# EAGLE board jamma-streamer (EAGLE 9.6.2)
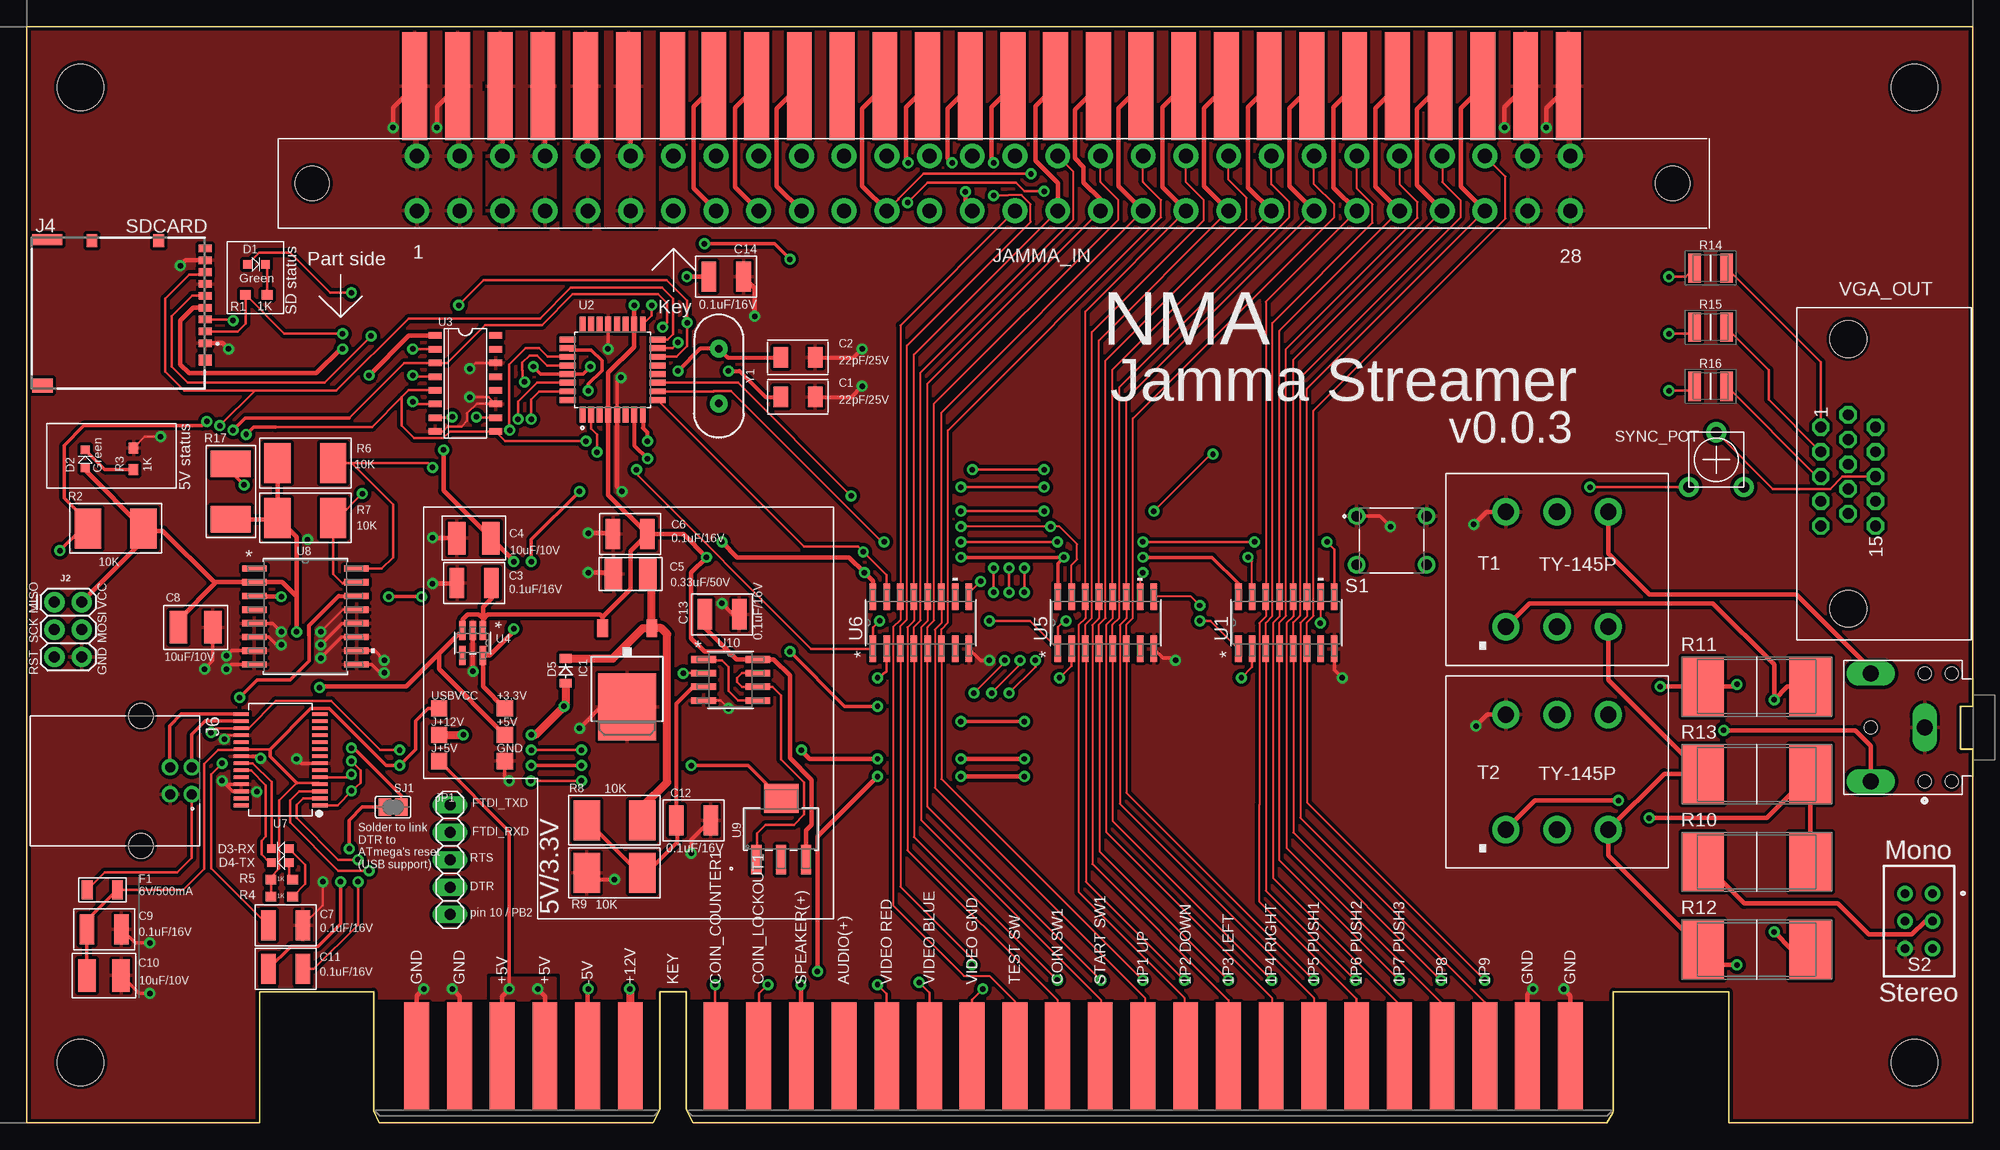
[diagram p7: board, top side]
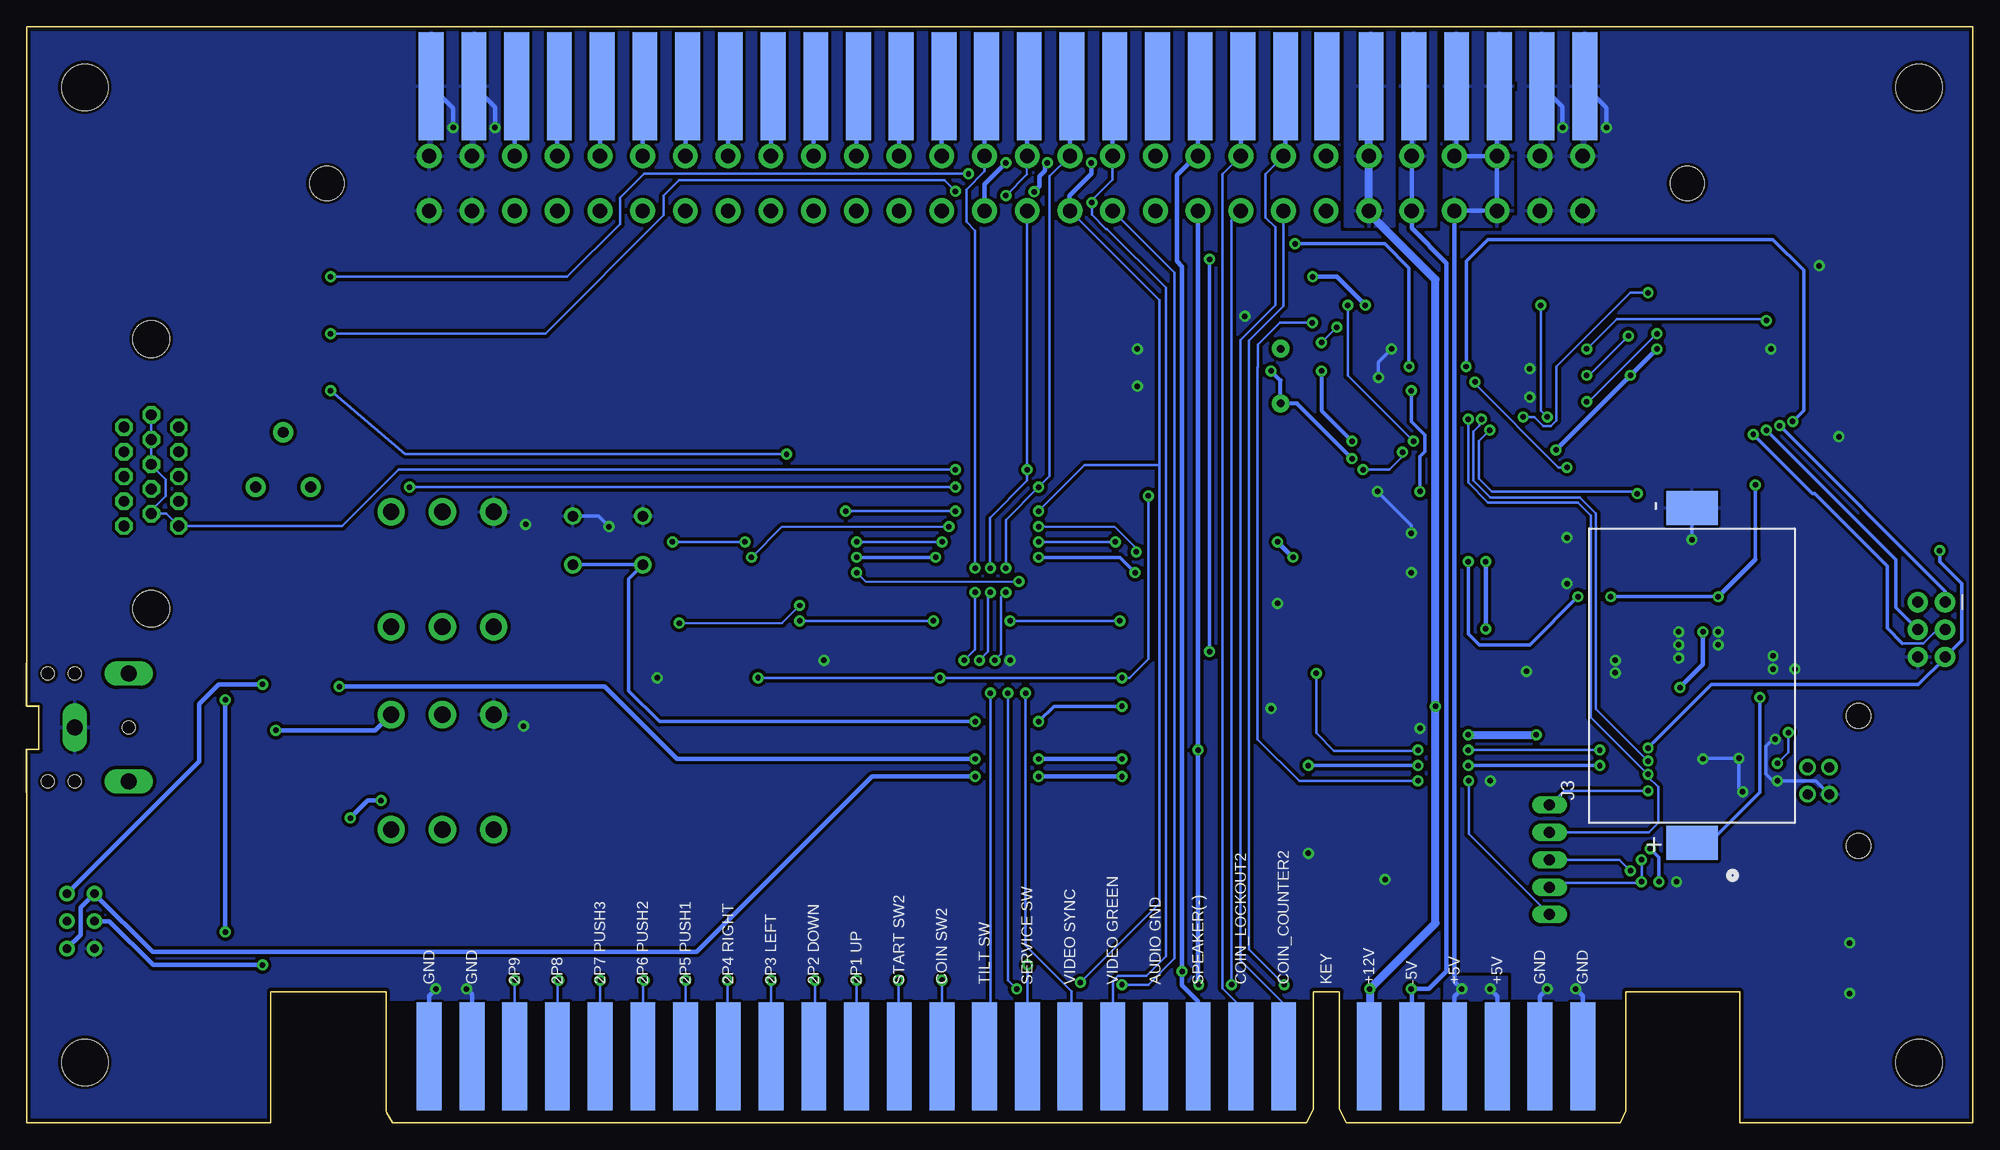
[diagram p8: board, bottom side, seen from below]

Size 180.34 x 101.59 mm. Coordinates in mm from the lower left corner, seen from the top.
Outline: 0,0 21.59,0 21.59,12.16 32.13,12.16 32.13,1.11 32.64,0 58.04,0 58.67,1.24 58.67,12.16 61.09,12.16 61.09,1.24 61.72,0 146.43,0 146.98,0.95 147.07,1.11 147.07,12.16 157.73,12.16 157.73,0 180.34,0 180.34,34.61 179.23,34.61 179.23,38.58 180.34,38.58 180.34,101.59 0,101.59 0,0
Copper layers (1*16): Top 0.035mm / dielectric 1.5mm / Bottom 0.035mm
Design rules "SparkFun": minimum track width 8mil, minimum drill 20mil, track to track 8mil, track to pad 8mil, pad to pad 8mil, via to via 8mil, smd to smd 8mil, copper to edge 10mil, drill to drill 8mil, minimum pad ring 12mil, minimum via ring 10mil, stop-mask expansion 4mil, vias tented up to drill 25mil, thermal gap 10mil
Holes 4.3 mm at 4.98,95.99 4.98,5.59 174.98,5.59 174.98,95.99
tKeepout: area 32.4,0 to 146.7,11.6
bKeepout: area 32.4,0 to 147.3,10.8
vRestrict: area 32,0 to 147.3,12.2

## Footprints (pad centres in the part's own frame; a part is rotated, then mirrored left to right if it is on the bottom)
TP15SQ = smd 1.5 x 1.5: TP 0,0
KEMET-C1206C220K3HACTU = smd 1.35 x 1.9: 1 -1.6,0; 2 1.6,0
KEMET-C1210C104K4J = smd 1.35 x 2.8: 1 -1.6,0; 2 1.6,0
KEMET-C1210C106K8N = smd 1.62 x 3.01: 1 -1.59,0; 2 1.59,0
KEMET-C1206X334K5R = smd 1.62 x 3.01: 1 -1.59,0; 2 1.59,0
604-APTD1608LCGCK = smd 0.8 x 0.8: + -0.825,0; - 0.825,0
DIODE-RRE07VTM4SFHTR = smd 0.8 x 1.1: 1 -1.15,0; 2 1.15,0
FUSE-1206L050YR = smd 1 x 1.8: 1 -1.4,0; 2 1.4,0
TO252 = smd 1 x 1.6: 1 -2.28,-4.8; 2 2.28,-4.8 | smd 5.4 x 6.2: 3 0,2.5
CUI_SJ1-3523N = drill 1.5 pad 2 long: 1 0,0; 2 5,-5; 3 5,5 | hole 1.2: -2.5,5; 0,5; 5,0; -2.5,-5; 0,-5
2X3 = drill 1.016 pad 1.88: 1 0,0; 2 0,2.54; 3 2.54,0; 4 2.54,2.54; 5 5.08,0; 6 5.08,2.54
796136-1 = smd 3.15 x 4.78: 1 -15.52,0; 2 15.52,0
DM3AT-SF-PEJM5_1 = smd 0.7 x 1.2: 1 -4.191,0.057; 2 -5.291,0.057; 3 -6.391,0.057; 4 -7.491,0.057; 5 -8.591,0.057; 6 -9.691,0.057; 7 -10.791,0.057; 8 -11.891,0.057; 10 -12.991,0.057 | smd 1.2 x 1: 9 -13.691,-10.443; 12 -13.691,-4.243 | smd 1 x 1.2: 11 -2.641,0.057 | smd 1 x 2.8: 13 -13.791,-14.593 | smd 1.3 x 1.9: 14 -0.291,-15.043
TE_292304-1 = drill 0.92: 1 1.25,4.71; 2 -1.25,4.71; 3 -1.25,2.71; 4 1.25,2.71 | hole 2.3: -6.02,0; 6.02,0
JAMMA_HORIZ_TOP = smd 2.3 x 10: 1 -53.46,0; 2 -49.5,0; 3 -45.54,0; 4 -41.58,0; 5 -37.62,0; 6 -33.66,0; 7 -29.55,0; 8 -25.74,0; 9 -21.78,0; 10 -17.82,0; 11 -13.86,0; 12 -9.9,0; 13 -5.94,0; 14 -1.98,0; 15 1.98,0; 16 5.94,0; 17 9.9,0; 18 13.86,0; 19 17.82,0; 20 21.78,0; 21 25.74,0; 22 29.7,0; 23 33.66,0; 24 37.62,0; 25 41.58,0; 26 45.54,0; 27 49.5,0; 28 53.46,0
JAMMA_HORIZ_BOTTOM = smd 2.3 x 10 bottom: _A 33.66,0; _B 37.62,0; _C 41.58,0; _D 45.54,0; _E 49.5,0; _F 53.46,0; A -53.46,0; B -49.5,0; C -45.54,0; D -41.58,0; E -37.62,0; F -33.66,0; H -29.55,0; J -25.74,0; K -21.78,0; L -17.82,0; M -13.86,0; N -9.9,0; P -5.94,0; R -1.98,0; S 1.98,0; T 5.94,0; U 9.9,0; V 13.86,0; W 17.82,0; X 21.78,0; Y 25.74,0; Z 29.7,0
JAMMA_FEMALE_56 = drill 1.32 pad 2.3: 1 -53.34,-2.54; 2 -49.38,-2.54; 3 -45.42,-2.54; 4 -41.46,-2.54; 5 -37.5,-2.54; 6 -33.54,-2.54; 7 -29.58,-2.54; 8 -25.62,-2.54; 9 -21.66,-2.54; 10 -17.7,-2.54; 11 -13.74,-2.54; 12 -9.78,-2.54; 13 -5.82,-2.54; 14 -1.86,-2.54; 15 2.1,-2.54; 16 6.06,-2.54; 17 10.02,-2.54; 18 13.98,-2.54; 19 17.94,-2.54; 20 21.9,-2.54; 21 25.86,-2.54; 22 29.82,-2.54; 23 33.78,-2.54; 24 37.74,-2.54; 25 41.7,-2.54; 26 45.66,-2.54; 27 49.62,-2.54; 28 53.58,-2.54; _A 33.78,2.54; _B 37.74,2.54; _C 41.7,2.54; _D 45.66,2.54; _E 49.62,2.54; _F 53.58,2.54; A -53.34,2.54; B -49.38,2.54; C -45.42,2.54; D -41.46,2.54; E -37.5,2.54; F -33.54,2.54; H -29.58,2.54; J -25.62,2.54; K -21.66,2.54; L -17.7,2.54; M -13.74,2.54; N -9.78,2.54; P -5.82,2.54; R -1.86,2.54; S 2.1,2.54; T 6.06,2.54; U 10.02,2.54; V 13.98,2.54; W 17.94,2.54; X 21.9,2.54; Y 25.86,2.54; Z 29.82,2.54 | hole 3.18: 63.055,0; -63.055,0
JAMMA_BOTTOM = smd 2.3 x 10 bottom: _A 33.66,0; _B 37.62,0; _C 41.58,0; _D 45.54,0; _E 49.5,0; _F 53.46,0; A -53.46,0; B -49.5,0; C -45.54,0; D -41.58,0; E -37.62,0; F -33.66,0; J -25.74,0; K -21.78,0; L -17.82,0; M -13.86,0; N -9.9,0; P -5.94,0; R -1.98,0; S 1.98,0; T 5.94,0; U 9.9,0; V 13.86,0; W 17.82,0; X 21.78,0; Y 25.74,0; Z 29.7,0
JAMMA_TOP = smd 2.3 x 10: 1 -53.46,0; 2 -49.5,0; 3 -45.54,0; 4 -41.58,0; 5 -37.62,0; 6 -33.66,0; 8 -25.74,0; 9 -21.78,0; 10 -17.82,0; 11 -13.86,0; 12 -9.9,0; 13 -5.94,0; 14 -1.98,0; 15 1.98,0; 16 5.94,0; 17 9.9,0; 18 13.86,0; 19 17.82,0; 20 21.78,0; 21 25.74,0; 22 29.7,0; 23 33.66,0; 24 37.62,0; 25 41.58,0; 26 45.54,0; 27 49.5,0; 28 53.46,0
1X05 = drill 1.016 long: 1 -5.08,0; 2 -2.54,0; 3 0,0; 4 2.54,0; 5 5.08,0
652-CHP0603FX1001ELF = smd 1 x 0.9: 1 -1,0; 2 1,0
BOURNS-CRM2512AJW-103ELF = smd 2.45 x 3.7: 1 -2.575,0; 2 2.575,0
TE_3550_SERIES = smd 3.9 x 5.5: 1 -5,0; 2 5,0
RESC3225X70N = smd 1.15 x 2.7: 1 -1.5,0; 2 1.5,0
SW_1825910-7 = drill 0.99: 1 -3.25,2.25; 2 3.25,2.25; 3 -3.25,-2.25; 4 3.25,-2.25
SS22SDP2(DPDT) = drill 0.8 pad 1.3: 1 1.27,2.54; 2 1.27,0; 3 1.27,-2.54; 4 -1.27,2.54; 5 -1.27,0; 6 -1.27,-2.54
SJ = smd 1.168 x 1.6: 1 -0.762,0; 2 0.762,0
TRIM_POT_PTH = drill 1 pad 1.88: 1 -2.54,-2.54; 2 0,2.54; 3 2.54,-2.54
TRIAD-TY-145P = drill 1.524 pad 2.54: 1 -4.75,-5.334; 2 0,-5.334; 3 4.75,-5.334; 4 4.75,5.334; 5 0,5.334; 6 -4.75,5.334
D16-M = smd 2.489 x 0.61: 1 -2.413,4.445; 2 -2.413,3.175; 3 -2.413,1.905; 4 -2.413,0.635; 5 -2.413,-0.635; 6 -2.413,-1.905; 7 -2.413,-3.175; 8 -2.413,-4.445; 9 2.413,-4.445; 10 2.413,-3.175; 11 2.413,-1.905; 12 2.413,-0.635; 13 2.413,0.635; 14 2.413,1.905; 15 2.413,3.175; 16 2.413,4.445
QFP80P900X900X120-32N = smd 1.47 x 0.55: 1 -4.17,2.8; 2 -4.17,2; 3 -4.17,1.2; 4 -4.17,0.4; 5 -4.17,-0.4; 6 -4.17,-1.2; 7 -4.17,-2; 8 -4.17,-2.8; 17 4.17,-2.8; 18 4.17,-2; 19 4.17,-1.2; 20 4.17,-0.4; 21 4.17,0.4; 22 4.17,1.2; 23 4.17,2; 24 4.17,2.8 | smd 0.55 x 1.47: 9 -2.8,-4.17; 10 -2,-4.17; 11 -1.2,-4.17; 12 -0.4,-4.17; 13 0.4,-4.17; 14 1.2,-4.17; 15 2,-4.17; 16 2.8,-4.17; 25 2.8,4.17; 26 2,4.17; 27 1.2,4.17; 28 0.4,4.17; 29 -0.4,4.17; 30 -1.2,4.17; 31 -2,4.17; 32 -2.8,4.17
SO16 = smd 0.6 x 1.2: 1 -4.445,-2.8; 2 -3.175,-2.8; 3 -1.905,-2.8; 4 -0.635,-2.8; 5 0.635,-2.8; 6 1.905,-2.8; 7 3.175,-2.8; 8 4.445,-2.8; 9 4.445,2.8; 10 3.175,2.8; 11 1.905,2.8; 12 0.635,2.8; 13 -0.635,2.8; 14 -1.905,2.8; 15 -3.175,2.8; 16 -4.445,2.8
DBV5-M = smd 1.778 x 0.61: 1 -1.168,0.95; 2 -1.168,0; 3 -1.168,-0.95; 4 1.168,-0.95; 5 1.168,0.95
SSOP28DB = smd 0.348 x 1.397: 1 -4.225,-3.656; 2 -3.575,-3.656; 3 -2.925,-3.656; 4 -2.275,-3.656; 5 -1.625,-3.656; 6 -0.975,-3.656; 7 -0.325,-3.656; 8 0.325,-3.656; 9 0.975,-3.656; 10 1.625,-3.656; 11 2.275,-3.656; 12 2.925,-3.656; 13 3.575,-3.656; 14 4.225,-3.656; 15 4.225,3.656; 16 3.575,3.656; 17 2.925,3.656; 18 2.275,3.656; 19 1.625,3.656; 20 0.975,3.656; 21 0.325,3.656; 22 -0.325,3.656; 23 -0.975,3.656; 24 -1.625,3.656; 25 -2.275,3.656; 26 -2.925,3.656; 27 -3.575,3.656; 28 -4.225,3.656
21-0042B_16-M = smd 2.286 x 0.584: 1 -4.737,4.445; 2 -4.737,3.175; 3 -4.737,1.905; 4 -4.737,0.635; 5 -4.737,-0.635; 6 -4.737,-1.905; 7 -4.737,-3.175; 8 -4.737,-4.445; 9 4.737,-4.445; 10 4.737,-3.175; 11 4.737,-1.905; 12 4.737,-0.635; 13 4.737,0.635; 14 4.737,1.905; 15 4.737,3.175; 16 4.737,4.445
SOT-223-M = smd 0.94 x 2.718: 1 -2.3,-2.845; 2 0,-2.845; 3 2.3,-2.845 | smd 3.2 x 2.718: 4 0,2.845
D8-M = smd 2.286 x 0.61: 1 -2.515,1.905; 2 -2.515,0.635; 3 -2.515,-0.635; 4 -2.515,-1.905; 5 2.515,-1.905; 6 2.515,-0.635; 7 2.515,0.635; 8 2.515,1.905
HARTING-DSUB-15-FEMALE = drill 1 octagon: 1 -4.325,-5.87; 2 -2.035,-5.87; 3 0.255,-5.87; 4 2.545,-5.87; 5 4.835,-5.87; 6 -5.47,-3.33; 7 -3.18,-3.33; 8 -0.89,-3.33; 9 1.4,-3.33; 10 3.69,-3.33; 11 -4.325,-0.79; 12 -2.035,-0.79; 13 0.255,-0.79; 14 2.545,-0.79; 15 4.835,-0.79 | hole 3.4: 12.5,-3.33; -12.5,-3.33
HC49US = drill 0.7 pad 1.651: 1 -2.54,0; 2 2.54,0

## Placement (x,y rotation side)
+3.3V  PTR1TP15SQ  [TP15SQ]  44.3,38.4 0 top
+5V  PTR1TP15SQ  [TP15SQ]  44.3,35.97 0 top
C1  22pF/25V  [KEMET-C1206C220K3HACTU]  71.47,67.3 0 top
C2  22pF/25V  [KEMET-C1206C220K3HACTU]  71.47,70.94 0 top
C3  0.1uF/16V  [KEMET-C1210C104K4J]  41.46,50.04 0 top
C4  10uF/10V  [KEMET-C1210C106K8N]  41.42,54.21 0 top
C5  0.33uF/50V  [KEMET-C1206X334K5R]  55.96,50.86 180 top
C6  0.1uF/16V  [KEMET-C1210C104K4J]  55.92,54.57 180 top
C7  0.1uF/16V  [KEMET-C1210C104K4J]  23.97,18.3 180 top
C8  10uF/10V  [KEMET-C1210C106K8N]  15.65,45.92 0 top
C9  0.1uF/16V  [KEMET-C1210C104K4J]  7.14,17.94 0 top
C10  10uF/10V  [KEMET-C1210C106K8N]  7.14,13.65 0 top
C11  0.1uF/16V  [KEMET-C1210C104K4J]  23.97,14.27 180 top
C12  0.1uF/16V  [KEMET-C1210C104K4J]  61.77,28.04 0 top
C13  0.1uF/16V  [KEMET-C1210C104K4J]  64.41,47.14 0 top
C14  0.1uF/16V  [KEMET-C1210C104K4J]  64.82,78.44 0 top
D1  Green  [604-APTD1608LCGCK]  21.27,79.58 0 top
D2  Green  [604-APTD1608LCGCK]  5.4,61.56 90 top
D3-RX  Green  [604-APTD1608LCGCK]  23.5,25.4 180 top
D4-TX  Green  [604-APTD1608LCGCK]  23.5,24.13 180 top
D5  RRE07VTM4SFHTR  [DIODE-RRE07VTM4SFHTR]  49.94,41.89 270 top
F1  6V/500mA  [FUSE-1206L050YR]  6.99,21.59 0 top
GND  PTR1TP15SQ  [TP15SQ]  44.3,33.53 0 top
IC1  LM7805  [TO252]  55.63,41.05 180 top
J1  Audio line out  [CUI_SJ1-3523N]  175.9,36.65 180 top
J2  ICSP  [2X3]  2.54,48.26 270 top
J3  796136-1  [796136-1]  26.01,41.45 90 bottom
J4  DM3AT-SF-PEJM5  [DM3AT-SF-PEJM5_1]  16.46,68.07 270 top
J6  292304-1  [TE_292304-1]  10.57,31.7 270 top
J+5V  PTR1TP15SQ  [TP15SQ]  38.2,33.53 0 top
J+12V  PTR1TP15SQ  [TP15SQ]  38.2,35.97 0 top
JA1  JAMMA_HORIZ_TOP  [JAMMA_HORIZ_TOP]  89.41,96.11 0 top
JA2  JAMMA_HORIZ_BOTTOM  [JAMMA_HORIZ_BOTTOM]  89.41,96.11 0 top
JAMMA_IN  JAMMA_FEMALE_56  [JAMMA_FEMALE_56]  89.49,87.09 0 top
JAMMA_OUT_BTM  JAMMA_BOTTOM  [JAMMA_BOTTOM]  89.59,6.17 0 top
JAMMA_OUT_TOP  JAMMA_TOP  [JAMMA_TOP]  89.59,6.17 0 top
JP1  [1X05]  39.22,24.38 270 top
R1  1K  [652-CHP0603FX1001ELF]  21.25,76.76 180 top
R2  10K  [BOURNS-CRM2512AJW-103ELF]  8.22,55.1 180 top
R3  1K  [652-CHP0603FX1001ELF]  9.88,61.56 90 top
R4  1K  [652-CHP0603FX1001ELF]  23.62,20.95 180 top
R5  1K  [652-CHP0603FX1001ELF]  23.62,22.54 180 top
R6  10K  [BOURNS-CRM2512AJW-103ELF]  25.81,61.16 0 top
R7  10K  [BOURNS-CRM2512AJW-103ELF]  25.81,56.08 0 top
R8  10K  [BOURNS-CRM2512AJW-103ELF]  54.46,28.04 0 top
R9  10K  [BOURNS-CRM2512AJW-103ELF]  54.46,23.16 0 top
R10  75 ohms  [TE_3550_SERIES]  160.32,24.18 0 top
R11  75 ohms  [TE_3550_SERIES]  160.32,40.44 0 top
R12  8.2 ohms  [TE_3550_SERIES]  160.32,16.05 0 top
R13  8.2 ohms  [TE_3550_SERIES]  160.32,32.31 0 top
R14  220 ohms  [RESC3225X70N]  156.06,79.25 0 top
R15  220 ohms  [RESC3225X70N]  156.06,73.76 0 top
R16  220 ohms  [RESC3225X70N]  156.06,68.28 0 top
R17  10K  [BOURNS-CRM2512AJW-103ELF]  18.9,58.52 90 top
S1  RESET SW  [SW_1825910-7]  126.49,53.99 0 top
S2  SS22SDP2  [SS22SDP2(DPDT)]  175.36,18.69 0 top
SJ1  [SJ]  33.93,29.26 0 top
SYNC_POT  1k  [TRIM_POT_PTH]  156.59,61.47 0 top
T1  TY-145P  [TRIAD-TY-145P]  141.83,51.3 0 top
T2  TY-145P  [TRIAD-TY-145P]  141.83,32.51 0 top
U1  CD74HC165MD16-M  [D16-M]  116.74,46.35 90 top
U2  ATMEGA328PB-AUR  [QFP80P900X900X120-32N]  54.28,69.81 90 top
U3  74HC4050D  [SO16]  40.63,68.54 270 top
U4  TLV757X / LP298X  [DBV5-M]  41.32,44.48 270 top
U5  CD74HC165MD16-M  [D16-M]  100,46.35 90 top
U6  CD74HC165MD16-M  [D16-M]  82.85,46.35 90 top
U7  FT232RL  [SSOP28DB]  23.5,33.66 90 top
U8  DS3231SNT&R21-0042B_16-M  [21-0042B_16-M]  25.81,46.94 0 top
U9  NDT2955SOT-223-M  [SOT-223-M]  69.9,27.23 0 top
U10  LM358DTD8-M  [D8-M]  65.23,41.05 0 top
USBVCC  PTR1TP15SQ  [TP15SQ]  38.2,38.4 0 top
VGA_OUT  VGA out  [HARTING-DSUB-15-FEMALE]  172.15,60.16 270 top
Y1  16MHz  [HC49US]  64.14,69.22 270 top

## Tracks (layer width: path | path; a pad name or v marks a point on that pad's centre or on a via)
8  (via drill 0.51)
  Top 0.254: v63.8,12.8 63.8,6.21 JAMMA_OUT_TOP.8
  Top 0.406: JAMMA_IN.8 61.77,86.64 61.77,94.22 JA1.8
  Bottom 0.254: JAMMA_IN.8 63.87,75.73 67.08,72.52 67.08,16.08 v63.8,12.8
9  (via drill 0.51)
  Top 0.254: v68.68,12.8 67.87,11.99 67.87,6.22 JAMMA_OUT_TOP.9
  Top 0.406: JAMMA_IN.9 65.63,86.74 65.63,94.12 JA1.9
  Bottom 0.254: JAMMA_IN.9 68.68,83.69 v68.68,12.8
15  (via drill 0.51)
  Top 0.203: U6.14 80.95,46.61 80.29,45.95 80.29,20.16 86.84,13.61 89.2,13.61 91.57,11.25 JAMMA_OUT_TOP.15 | JAMMA_IN.15 80.95,73.91 80.95,48.97
  Top 0.254: 80.95,48.97 U6.14
  Top 0.406: v89.61,89 89.41,89.2 89.41,94.13 JA1.15
  Bottom 0.406: JAMMA_IN.15 91.59,87.03 v89.61,89
16
  Top 0.203: JAMMA_OUT_TOP.16 95.5,6.19 95.5,11.38 81.61,25.27 81.61,45.92 82.22,46.53 U6.13 82.22,71.22 JAMMA_IN.16
  Top 0.406: JAMMA_IN.16 95.55,87.13 93.47,89.2 93.47,94.24 JA1.16
17
  Top 0.203: JAMMA_OUT_TOP.17 99.57,6.24 99.57,11.38 82.88,28.07 82.88,45.92 83.49,46.53 U6.12 83.49,68.53 99.33,84.37
  Top 0.254: 99.33,84.37 JAMMA_IN.17
  Top 0.406: JAMMA_IN.17 99.51,85.61 97.94,87.17 97.94,88.59 97.13,89.41 97.13,93.94 JA1.17
18
  Top 0.203: JAMMA_OUT_TOP.18 103.63,6.35 103.63,11.58 84.15,31.06 84.15,45.72 84.76,46.33 U6.11 84.76,65.84 JAMMA_IN.18
  Top 0.406: JAMMA_IN.18 101.19,86.82 101.19,94.04 JA1.18
19
  Top 0.203: JAMMA_IN.19 98.09,75.22 U5.14 98.09,46.75 97.48,46.14 97.48,21.39 107.29,11.58 107.29,6.29 JAMMA_OUT_TOP.19
  Top 0.406: JAMMA_IN.19 105.26,86.72 105.26,94.14 JA1.19
20
  Top 0.203: JAMMA_IN.20 99.36,72.53 U5.13 99.36,46.75 98.75,46.14 98.75,23.98 111.37,11.36 JAMMA_OUT_TOP.20
  Top 0.406: JAMMA_IN.20 109.12,86.82 109.12,94.04 JA1.20
21
  Top 0.203: JAMMA_IN.21 100.64,69.83 U5.12 100.64,46.75 100.03,46.14 100.03,26.98 115.42,11.58 115.42,6.25 JAMMA_OUT_TOP.21
  Top 0.406: JAMMA_IN.21 113.18,86.71 113.18,94.15 JA1.21
22
  Top 0.203: 119.18,84.42 101.91,67.14 U5.11 101.91,46.75 101.3,46.14 101.3,29.57 119.29,11.57 JAMMA_OUT_TOP.22
  Top 0.254: 119.18,84.42 JAMMA_IN.22
  Top 0.406: JAMMA_IN.22 117.04,86.81 117.04,94.05 JA1.22
23
  Top 0.203: 123.25,11.47 114.2,20.52 114.2,29.46 114.22,29.49 114.22,46.32 114.83,46.93 U1.14 114.83,76.11 JAMMA_IN.23
  Top 0.254: 123.25,11.47 JAMMA_OUT_TOP.23
  Top 0.406: JAMMA_IN.23 121.11,86.71 121.11,94.15 JA1.23
24
  Top 0.203: JAMMA_IN.24 116.1,73.42 U1.13 116.1,46.96 115.49,46.35 115.49,22.68 127.21,10.96
  Top 0.254: 127.21,10.96 JAMMA_OUT_TOP.24
  Top 0.406: JAMMA_IN.24 124.97,86.81 124.97,94.05 JA1.24
25
  Top 0.203: JAMMA_IN.25 117.37,70.73 U1.12 117.37,46.96 116.76,46.35 116.76,25.48 131.17,11.07
  Top 0.254: 131.17,11.07 JAMMA_OUT_TOP.25
  Top 0.406: JAMMA_IN.25 128.83,86.91 128.83,93.95 JA1.25
26
  Top 0.203: JAMMA_IN.26 118.64,68.04 U1.11 118.64,46.96 118.03,46.35 118.03,28.27 135.13,11.17
  Top 0.254: 135.13,11.17 JAMMA_OUT_TOP.26
  Top 0.406: JAMMA_IN.26 132.89,86.8 132.89,94.06 JA1.26
_A  (via drill 0.51)
  Top 0.203: JAMMA_IN._A 123.27,86.6 124.72,85.15 124.72,83.43 115.44,74.15 115.44,46.97 114.83,46.35 U1.3 114.83,21.51 v123.14,13.21
  Bottom 0.254: v123.14,13.21 123.25,13.1 JAMMA_OUT_BTM._A
  Bottom 0.406: JAMMA_IN._A 123.27,95.92 JA2._A
_B  (via drill 0.51)
  Top 0.203: U1.4 116.1,46.38 116.71,46.99 116.71,71.74 128.88,83.91 128.88,85.35 127.23,87.01 JAMMA_IN._B | v127.2,13.21 116.1,24.31 116.1,43.69
  Top 0.254: 116.1,43.69 U1.4
  Bottom 0.254: v127.2,13.21 v127.21,13.2 JAMMA_OUT_BTM._B
  Bottom 0.406: JAMMA_IN._B 127.23,95.92 JA2._B
_C  (via drill 0.51)
  Top 0.203: JAMMA_IN._C 131.19,87.21 132.84,85.56 132.84,83.91 117.98,69.05 117.98,46.99 117.37,46.38 U1.5 117.37,26.9 v131.06,13.21
  Bottom 0.254: v131.06,13.21 131.17,13.1 JAMMA_OUT_BTM._C
  Bottom 0.406: JAMMA_IN._C 131.19,95.92 JA2._C
_D  (via drill 0.51)
  Top 0.203: JAMMA_IN._D 137.06,87.72 137.06,83.82 119.25,66.02 119.25,46.99 118.64,46.38 U1.6 118.64,29.69 v135.13,13.21
  Bottom 0.254: v135.13,13.21 JAMMA_OUT_BTM._D
  Bottom 0.406: JAMMA_IN._D 135.15,95.92 JA2._D
BLUE  (via drill 0.51)
  Top 0.254: v82.7,13.01 83.65,12.06 JAMMA_OUT_TOP.13 | v86.56,56.69 v94.28,56.69 | v104.44,56.69 109.73,61.98 v109.93,61.98 | v152.2,67.87 154.15,67.87 R16.1
  Top 0.406: v81.69,89 81.48,89.2 81.48,94.13 JA1.13
  Bottom 0.254: JAMMA_IN.13 75.39,76.27 75.39,60.96 | v82.7,13.01 75.39,20.32 75.39,60.96 | 75.39,60.96 82.3,60.96 v86.56,56.69 | v94.28,56.69 v104.44,56.69 | v152.2,67.87 145.29,61.98 v109.93,61.98
  Bottom 0.406: v81.69,89 81.69,87.99 83.72,85.95 83.72,84.6 JAMMA_IN.13
CLK  (via drill 0.51)
  Top 0.254: v51.82,63.2 44.34,63.2 U3.9 39.2,64.09 38.57,63.47 35.9,63.47 34.75,64.62 34.75,67.26 | v57.91,75.79 57.91,74.81 U2.17 | U3.5 35.39,67.91 34.75,67.26 | 34.75,67.26 31.98,64.49 23.05,64.49
  Top 0.305: 23.05,64.49 21.01,64.49 v20.32,63.8
  Bottom 0.254: J2.3 3.28,45.72 4.55,44.45 6.5,44.45 | v51.82,63.2 57.91,69.29 v57.91,75.79
  Bottom 0.305: v20.32,63.8 14.83,58.32 14.63,58.32 7.92,51.61 7.92,45.87 6.5,44.45
CMD_GATE
  Top 0.254: U9.1 67.67,24.38 67.67,26.82 68.48,27.64 71.09,27.64 72.03,28.58 72.03,31.57 69.9,33.7 69.9,39.62 69.11,40.41 U10.6 66.27,40.41 65.84,40.84 65.84,41.25 66.27,41.68 U10.7
CMP
  Top 0.356: R8.1 56.76,23.16 R9.2 57.44,23.16 60.26,25.99 60.26,27.95 C12.1 60.17,38.84 61.75,40.41 U10.3
CS  (via drill 0.51)
  Top 0.254: v39.42,65.43 39.35,65.36 U3.7 | U2.14 60.21,71.01 61.19,71.99 v61.19,74.17 61.19,76.21 59.28,78.11 42.35,78.11 v40.03,75.79 | v51.41,31.7 v46.71,31.7
  Bottom 0.254: v40.03,75.79 40.03,66.04 v39.42,65.43 | v61.19,74.17 64.21,74.17 66.24,72.14 66.24,70.07 66.27,70.05 66.27,35.56 62.41,31.7 v51.41,31.7 | JP1.5 46.71,26.79 v46.71,31.7
D+
  Top 0.305: U7.15 14.31,37.88 13.21,36.78 13.21,33.02 J6.3
D-
  Top 0.305: J6.2 15.28,36 16.5,37.23 U7.16
DI  (via drill 0.51)
  Top 0.254: U2.15 59.82,71.81 v60.35,72.34 | v58.93,73.76 59.33,74.17 59.33,76 58.52,76.81 50.6,76.81 47.75,73.97 42.47,73.97 38.95,70.44 U3.3 34.95,70.44 29.86,65.35
  Top 0.305: v19.1,64.21 20.24,65.35 29.86,65.35
  Bottom 0.254: v60.35,72.34 v58.93,73.76
  Bottom 0.305: v19.1,64.21 7.11,52.22 7.11,47.75 J2.4
DO  (via drill 0.51)
  Top 0.254: U2.16 59.4,72.61 59.89,73.1 59.89,76.4 58.88,77.42 50.39,77.42 47.55,74.57 35.36,74.57 28.65,67.87 21.13,67.87 | J4.7 16.29,78.64 15.04,78.64 12.8,76.4 12.8,69.66 14.59,67.87 21.13,67.87 | v17.88,64.62 21.13,67.87
  Bottom 0.305: J2.1 2.54,49.28 v17.88,64.62
DTR  (via drill 0.51)
  Top 0.254: v30.68,24.38 28.85,24.38 24.99,28.25 24.99,29.46 25.61,30.08 U7.2 | C11.1 26.59,14.27 30.68,18.36 v30.68,22.35
  Bottom 0.254: v30.68,24.38 30.66,24.36 30.66,22.53 30.68,22.5 v30.68,22.35 30.79,22.25 38.81,22.25 JP1.4
FTDI_RXD  (via drill 0.51)
  Top 0.254: U2.31 47.49,67.81 46.74,67.06 v46.74,65.23 | v30.07,32.31 29.8,32.03 U7.5
  Bottom 0.254: v46.74,65.23 46.74,59.33 44.91,57.51 36.58,57.51 35.36,56.29 35.36,37.59 v30.07,32.31 30.07,32.07 29.13,31.13 29.13,27.8 30.01,26.92 JP1.2
FTDI_TXD  (via drill 0.51)
  Top 0.254: U2.30 47.27,68.61 45.52,66.85 v45.52,65.23 | U7.1 28.82,29.43 v30.07,30.79 30.91,31.52 30.91,32.66 30.07,33.49 v30.07,33.53
  Bottom 0.254: v30.07,33.53 34.9,38.35 34.9,56.48 36.39,57.96 44.7,57.96 46.28,59.54 46.28,64.06 45.72,64.62 45.72,65.02 v45.52,65.23 | JP1.1 37.9,30.79 v30.07,30.79
GND  (via drill 0.51)
  Top 0.254: U3.8 38.55,64.09 39.01,64.55 40.29,64.55 40.82,65.08 40.82,65.78 41.72,66.67 43.4,66.67 | U3.11 43.4,66.67 | R3.2 10.92,63.6 v12.39,63.6 | C7.1 27.43,20.16 v27.43,22.35 | U7.18 18.66,35.93 v18.29,35.56 | 43.4,66.67 42.81,67.26 v41.05,67.26 | U3.14 41.59,70.44 v41.05,69.9 | U8.13 29.29,47.57 v27.23,45.52 | U10.4 64.29,39.14 v65.02,38.41
  Top 0.305: U2.21 53.88,71.77 v53.85,71.73 | U6.8 88.37,42.88 v89.2,42.88 | U5.8 105.31,43.08 106.27,43.08 v106.48,42.88 | U7.7 25.39,33.33 v24.99,33.73 | U7.21 21.46,33.98 v21.65,33.79 | U7.25 18.4,31.38 v18.09,31.7 19.05,30.73 U7.26 | S1.1 125.42,56.24 v126.39,55.27 | U8.12 29.23,46.3 v27.23,44.3 | U8.11 29.18,45.03 v27.23,43.08 | U8.10 32.23,43.76 v33.12,42.88 | U8.9 31.93,42.49 32.72,41.71 v33.12,41.71 | U8.5 22.78,46.3 v23.57,45.52 | U8.6 22.43,45.03 23.16,44.3 v23.57,44.3 | C8.2 17.24,42.84 v16.46,42.06 | U8.7 18.97,43.76 v18.49,43.28 | U8.8 18.92,42.49 v18.49,42.06 | C10.2 10.4,11.99 v11.38,11.99 | C9.2 10.02,16.66 v11.38,16.66 | GND.TP 44.3,32.11 v44.7,31.7 | U1.8 121.18,41.99 v121.92,41.25 | U2.5 54.69,68.71 v55.07,69.09
  Top 0.356: C2.2 76.63,70.94 v77.42,71.73 | C1.2 76.44,67.3 v77.42,68.28 | IC1.3 53.19,38.55 v51.21,36.58 | R9.1 52.49,22.55 v54.46,22.55 | C13.2 65.43,47.14 v64.41,48.16 | C12.2 61.57,26.24 v61.57,24.99
  Top 0.406: JAMMA_OUT_TOP.1 36.13,11.75 v36.78,12.39 | v39.42,12.39 40.09,11.72 JAMMA_OUT_TOP.2 | JAMMA_OUT_TOP.28 143.05,11.79 v142.44,12.39 | v139.6,12.39 139.09,11.89 JAMMA_OUT_TOP.27 | U2.5 54.69,58.99 v55.16,58.52 | C5.2 54.23,51 v52.02,51 | C6.2 54.23,54.66 v52.02,54.66 | C4.1 37.64,54.21 v37.59,54.25 | C3.1 39.8,49.99 v37.59,49.99 | C14.2 67.46,77.39 v67.46,74.78 | J4.8 14.74,79.96 v14.22,79.45 | J4.1 18.16,72.26 v18.69,71.73 | T2.6 135.38,37.85 v134.31,36.78 | T1.6 135.27,56.64 v134.11,55.47 | JA1.1 33.93,94.1 v33.93,92.25 | v38,92.25 38,94.2 JA1.2 | v140.82,92.25 140.82,94.06 JA1.28 | JA1.27 136.96,94.16 v136.96,92.25 | U4.2 41.32,41.9 v41.35,41.86
  Bottom 0.305: v26.01,54.05 J3.2 | S1.2 127.36,56.24 v126.39,55.27 | v18.29,35.56 18.49,35.56 19.15,34.9 19.15,32.36 18.49,31.7 v18.09,31.7 14.53,31.7 J6.4 | v24.99,33.73 24.93,33.79 v21.65,33.79 21.65,31.03 v21.31,30.69 | v55.16,58.52 52.02,55.39 v52.02,54.66 | v55.07,69.09 55.07,70.51 v53.85,71.73
  Bottom 0.406: v36.78,12.39 36.13,11.75 JAMMA_OUT_TOP.1 | JAMMA_OUT_TOP.2 40.09,11.72 v39.42,12.39 | v142.44,12.39 143.05,11.79 JAMMA_OUT_TOP.28 | JAMMA_OUT_TOP.27 139.09,11.89 v139.6,12.39 | v33.93,92.25 33.93,94.1 JA1.1 | JA1.2 38,94.2 v38,92.25 | JA1.28 140.82,94.06 v140.82,92.25 | v136.96,92.25 136.96,94.16 JA1.27
  pour Bottom: 35.1,10.8 36.9,10.5 35.1,10.5
  pour Top (isolate 0.305, rank 6): 0,101.63 0,0 21.59,0 21.59,12.24 32.31,12.24 32.31,11.58 58.52,11.58 58.52,12.19 61.16,12.19 61.16,11.58 146.91,11.38 146.91,12.24 157.71,12.24 157.71,0 180.34,0 180.34,34.61 179.23,34.61 179.23,38.58 180.35,38.58 180.35,101.63
  pour Bottom (isolate 0.305, rank 6): 0,101.63 0,0 21.59,0 21.59,12.24 32.31,12.24 32.31,11.58 58.52,11.58 58.52,12.19 61.16,12.19 61.16,11.58 146.91,11.38 146.91,12.24 157.71,12.24 157.71,0 180.34,0 180.34,3.49 180.35,34.55 179.22,34.55 179.22,38.61 180.34,38.61 180.34,101.63
  pour Bottom (isolate 0.305): 35.15,10.36 35.15,13.46 41.05,13.46 41.05,10.36 39.22,10.36 39.22,11.38 36.98,11.38 36.98,10.36
  pour Bottom (isolate 0.305): 138.18,13.61 144.07,13.61 144.07,9.96 142.04,9.96 142.04,11.58 140,11.58 140,9.96 138.18,9.96 138.18,13.41
  pour Top (isolate 0.305): 35.15,13.41 41.05,13.41 41.05,10.77 39.22,10.77 39.22,11.38 36.98,11.38 36.98,10.77 35.15,10.77
  pour Top (isolate 0.305): 138.18,13.61 144.07,13.61 144.07,10.57 142.04,10.57 142.04,11.58 140,11.58 140,10.57 138.18,10.57
GREEN  (via drill 0.51)
  Top 0.254: v94.28,86.36 92.44,86.36 91.66,87.15 83.46,87.15 v81.62,85.31 | v152.2,73.15 153.95,73.15 R15.1
  Bottom 0.254: JAMMA_IN.N 79.71,87.45 81.62,85.54 v81.62,85.31 81.62,84.17 80.32,82.86 80.22,82.86 74.78,77.42 74.78,15.44 76.58,13.64 79.19,13.64 79.69,13.14 JAMMA_OUT_BTM.N | v94.28,86.36 95.3,87.38 119.89,87.38 121.31,85.95 121.31,84.12 132.28,73.15 v152.2,73.15
  Bottom 0.406: JAMMA_IN.N 79.71,95.92 JA2.N
J
  Bottom 0.254: JAMMA_IN.J 65.55,87.94 65.55,83.93 64.64,83.02 64.64,75.81 67.87,72.58 67.87,15.04 63.8,10.97 63.8,6.21 JAMMA_OUT_BTM.J
  Bottom 0.406: JAMMA_IN.J 63.67,89.83 JA2.J
JAMMA+5V  (via drill 0.51)
  Top 0.305: v44.7,12.39 44.7,27.03 J+5V.TP
  Top 0.406: JAMMA_OUT_BTM.C 44.05,11.74 v44.7,12.39 | v47.35,12.39 48.01,11.73 JAMMA_OUT_BTM.D | JAMMA_IN.C 44.07,95.92 JA2.C | JAMMA_IN.D 48.03,95.92 JA2.D
  Bottom 0.406: v44.7,12.39 44.05,11.74 JAMMA_OUT_BTM.C | JAMMA_OUT_BTM.D 48.01,11.73 v47.35,12.39 48.03,13.08 JAMMA_IN.4 JAMMA_IN.3 JAMMA_IN.C | JAMMA_IN.C JAMMA_IN.D 47.83,89.83 JA2.D | JAMMA_IN.C 44.07,95.92 JA2.C
  pour Bottom (isolate 0.305): 43.2,10.5 43.2,13.5 48.9,13.5 48.9,10.8 47.1,10.8 47.1,11.4 45,11.4 45,10.5
  pour Bottom (isolate 0.305): 42.67,101.6 48.97,101.6 48.97,83.11 42.67,83.11
  pour Top (isolate 0.305): 43.08,13.41 48.97,13.41 48.97,10.97 47.14,10.97 47.14,11.38 45.11,11.38 45.11,10.77 43.08,10.77
  pour Top (isolate 0.305): 42.67,101.4 48.97,101.4 48.97,83.11 42.67,83.11
JAMMA+12V  (via drill 0.51)
  Top 0.406: JAMMA_IN.F 55.95,95.92 JA1.6
  Top 0.762: D5.2 49.94,38.77 v49.78,38.61 47.14,35.97 v46.74,35.97 | JAMMA_OUT_BTM.F 55.93,12.34 v55.88,12.39 | J+12V.TP v40.44,35.97
  Bottom 0.762: JAMMA_OUT_BTM.F 55.88,6.22 v55.88,12.39 49.78,18.49 v49.78,38.61 49.78,78.18 55.95,84.34 JAMMA_IN.6 JAMMA_IN.F 55.95,95.92 JA1.6 | v46.74,35.97 v40.44,35.97
  pour Top (isolate 0.305): 53.64,101.4 58.12,101.4 58.12,83.11 53.64,83.11
  pour Bottom (isolate 0.305): 53.64,101.6 58.12,101.6 58.12,83.11 53.64,83.11
JAMMA-5V  (via drill 0.51)
  Top 0.406: JAMMA_OUT_TOP.5 51.97,12.35 v52.02,12.39 | JAMMA_IN.E 51.99,95.92 JA1.5
  Bottom 0.406: JAMMA_OUT_TOP.5 51.97,12.35 v52.02,12.39 50.39,12.39 48.77,14.02 48.77,79.7 51.99,82.92 JAMMA_IN.5 JAMMA_IN.E 51.99,95.92 JA1.5
  pour Top (isolate 0.305): 49.78,101.4 53.04,101.4 53.04,83.11 49.78,83.11
  pour Bottom (isolate 0.305): 49.78,101.6 53.04,101.6 53.04,83.11 49.78,83.11
K
  Bottom 0.254: JAMMA_IN.K 69.52,87.93 69.52,12.45 68.07,11.01 68.07,6.43 JAMMA_OUT_BTM.K
  Bottom 0.406: JAMMA_IN.K 67.83,95.92 JA2.K
N$1
  Top 0.254: VGA_OUT.1 166.28,64.62 166.28,70.53 R14.2
N$2
  Top 0.254: VGA_OUT.2 161.44,67.03 161.44,69.8 157.56,73.68 R15.2
N$3
  Top 0.254: VGA_OUT.13 168.29,59.91 167.15,58.77 161.83,58.77 SYNC_POT.2
N$4
  Top 0.406: S2.2 175.96,18.69 174.72,17.46 170.71,17.46 167.84,20.32 159.19,20.32 R10.1
N$8
  Top 0.254: U7.22 20.93,33.33 22.67,31.58 D3-RX.-
N$9  (via drill 0.51)
  Top 0.203: U5.10 103.23,48.82 103.23,50.8 v103.43,51 | v88.39,50.19 87.3,49.1 U6.9
  Bottom 0.203: v103.43,51 102.62,50.19 v88.39,50.19
N$10  (via drill 0.51)
  Top 0.203: v108.71,47.95 107.9,48.77 U5.9 | U1.10 119.91,46.35 v119.89,46.33
  Bottom 0.203: v108.71,47.95 110.34,46.33 v119.89,46.33
N$11  (via drill 0.51)
  Top 0.406: R11.2 163.17,40.44 v161.95,39.22 161.95,42.47 156.26,48.16 139.28,48.16 T1.1 | v161.95,17.68 163.58,16.05 R12.2
  Bottom 0.406: v161.95,39.22 v161.95,17.68
N$12
  Top 0.305: D2.- 7.23,60.56 R3.1
N$13  (via drill 0.51)
  Top 0.305: C11.2 24.47,16.37 26.99,16.37 29.06,18.43 v29.06,22.35 | v29.87,25.4 29.87,28.04 31.09,29.26 SJ1.1
  Bottom 0.305: v29.06,22.35 29.06,24.59 v29.87,25.4
N$14  (via drill 0.51)
  Top 0.406: T2.1 139.78,29.87 v147.52,29.87 | v150.37,28.25 161.26,28.25 R13.2 R10.2
  Bottom 0.406: v147.52,29.87 148.74,29.87 v150.37,28.25
N$16
  Top 0.254: R16.2 165.93,59.91 VGA_OUT.3
N$18  (via drill 0.51)
  Top 0.254: U3.10 41.72,65.36 v41.66,65.43 | v30.07,76.95 28.11,76.95 24.38,80.67 21.53,80.67 D1.+
  Bottom 0.254: v41.66,65.43 40.61,65.43 39.77,64.59 39.07,64.59 38.58,65.08 38.58,70.1 31.73,76.95 v30.07,76.95
N$19
  Top 0.254: R1.1 22.25,79.43 D1.-
N$20
  Top 0.254: U7.23 20.76,32.68 22.15,31.29 22.15,26.55 21.74,26.14 21.74,24.86 22.47,24.13 D4-TX.-
N$21
  Top 0.254: D4-TX.+ 24.32,22.84 R5.1
N$22
  Top 0.254: R4.1 25.81,22.14 25.81,23.91 D3-RX.+
N$23
  Top 0.254: U10.1 62.79,42.88 64.41,42.88 65.02,42.27 65.02,40.03 65.91,39.14 U10.5
N$25  (via drill 0.51)
  Top 0.254: 155.28,32.35 R13.1 | 156.75,14.63 R12.1
  Top 0.406: T1.3 146.58,41.05 155.28,32.35 151.75,32.35 T2.3 146.58,24.79 R12.1 | v158.5,14.63 156.75,14.63
  Bottom 0.406: S2.5 172.72,18.69 168.66,14.63 v158.5,14.63
N$26
  Top 0.406: T1.4 146.58,52.76 150.37,48.97 163.98,48.97 170.9,42.05 J1.2
N$30  (via drill 0.51)
  Top 0.406: v157.28,36.37 169.47,36.37 170.9,34.94 J1.3
  Bottom 0.406: T2.4 148.06,36.37 v157.28,36.37
N$31  (via drill 0.51)
  Top 0.305: v19.71,39.42 21.34,41.05 24.38,41.05 26.14,42.8 26.14,45.18
  Top 0.356: 26.14,45.18 26.14,46.09 28.89,48.84 U8.14
  Bottom 0.305: J3.1 24.38,25.93 19.71,30.61 v19.71,39.42
P  (via drill 0.51)
  Top 0.254: v89.61,51.41 v89.61,49.17 | v90.63,42.88 90.63,42.67 v87.78,39.83 | v86.56,58.93 v94.28,58.93 | v144.88,58.93 SYNC_POT.1
  Bottom 0.254: JAMMA_IN.P 85.55,87.75 85.55,59.94 v86.56,58.93 89.61,55.88 v89.61,51.41 | v90.63,42.88 90.04,43.46 90.04,48.74 v89.61,49.17 | v87.78,39.83 87.78,16.46 83.52,12.19 83.52,6.3 JAMMA_OUT_BTM.P | v94.28,58.93 v144.88,58.93
  Bottom 0.406: JAMMA_IN.P 83.67,95.92 JA2.P
PB6  (via drill 0.51)
  Top 0.356: U2.7 56.28,62.79 v57.51,61.57 | v65.02,69.7 66.04,69.7 68.44,67.3 C1.1
  Bottom 0.356: v57.51,61.57 62.62,66.68 Y1.2 64.14,68.81 v65.02,69.7
PB7  (via drill 0.51)
  Top 0.254: U2.8 57.1,65.63
  Top 0.356: v60.35,69.7 62.41,71.76 Y1.1 64.95,70.94 C2.1 | 57.1,65.63 57.1,64.41 57.51,64.01 v57.51,63.2
  Bottom 0.356: v60.35,69.7 60.35,66.04 v57.51,63.2
PD4  (via drill 0.51)
  Top 0.254: v56.49,60.55 56.49,60.15 72.69,43.94 U6.1 78.41,45.9 v79.05,46.53 | v52.83,62.18 52.83,63.8 52.28,64.35 U2.2 | U1.1 109.7,46.53 v108.71,46.53 | v96.32,46.53 96.11,46.53 95.56,45.97 U5.1 92.96,46.53 v89.2,46.53
  Bottom 0.254: v56.49,60.55 54.05,60.55 52.83,61.77 v52.83,62.18 | v108.71,46.53 v96.32,46.53 | v89.2,46.53 v79.05,46.53
PD5  (via drill 0.51)
  Top 0.203: U5.15 96.83,51.71 97.33,52.22 97.33,53.65 95.71,55.27 v94.89,55.27 v86.56,55.27 | U1.15 113.56,52.05 v113.18,52.43
  Top 0.254: U2.9 72.02,53.44 77.01,53.44 v77.52,52.93 79.68,50.77 U6.15
  Bottom 0.203: v77.52,52.93 77.52,53.27 79.52,55.27 v86.56,55.27 | v113.18,52.43 110.34,55.27 v94.89,55.27
PD6  (via drill 0.51)
  Top 0.254: v113.79,53.85 v103.43,53.85 | v95.5,53.85 v86.56,53.85 | U2.10 63.63,67.81 63.66,67.83 65.26,67.83 79.25,53.85 v79.45,53.85 | v120.5,53.85 121.18,53.16 U1.9
  Bottom 0.254: v120.5,53.85 v113.79,53.85 | v103.43,53.85 v95.5,53.85 | v86.56,53.85 v79.45,53.85
PD7  (via drill 0.51)
  Top 0.254: v95.71,41.25 96.83,42.37 U5.2 | v112.57,41.25 113.56,42.24 U1.2 | U6.2 79.68,42.49 79.65,42.47 79.65,41.86 v78.84,41.25 | U2.11 65.91,68.61 v76.4,58.12
  Bottom 0.254: v112.57,41.25 v95.71,41.25 v78.84,41.25 78.13,41.25 76.4,42.98 v76.4,58.12
R  (via drill 0.51)
  Top 0.203: v87.58,14.63 87.58,15.24 80.95,21.87 U6.3 80.95,46.03 81.56,46.64 81.56,72.06 93.07,83.56 93.04,83.59 93.04,85.15 92.19,86 90.98,86 90.94,85.95 v89.61,85.95
  Bottom 0.203: v89.61,85.95 87.63,87.94 JAMMA_IN.R
  Bottom 0.254: v87.58,14.63 87.58,6.2 JAMMA_OUT_BTM.R
  Bottom 0.406: JAMMA_IN.R 87.63,95.92 JA2.R
RED  (via drill 0.51)
  Top 0.254: JAMMA_OUT_TOP.12 79.69,11.95 v78.84,12.8 | JAMMA_IN.12 80.78,85.62 80.78,85.66 83.11,87.99 v93.07,87.99 | v152.2,78.44 153.75,78.44 R14.1
  Top 0.406: JAMMA_IN.12 77.42,86.83 77.42,94.03 JA1.12
  Bottom 0.254: JAMMA_IN.12 73.97,78.81 73.97,15.24 76.4,12.8 v78.84,12.8 | v93.07,87.99 123.14,87.99 125.37,85.75 125.37,83.31 130.25,78.44 v152.2,78.44
RESET  (via drill 0.51)
  Top 0.254: 34.7,30.33 SJ1.2
  Top 0.305: v46.94,70.1 47.63,69.41 U2.29 51.53,69.41 v52.22,70.1 | v30.07,34.75 30.28,34.75 34.7,30.33 | v3.05,53.03 5.11,55.1 R2.2 5.64,55.71 3.45,57.9 3.45,62.79 5.28,64.62 16.26,64.62 v16.66,65.02 | v70.71,43.69 75.79,38.61 v78.84,38.61 | v86.56,37.19 v92.46,37.19 | v62.79,81.48 69.29,81.48 v70.71,80.06
  Bottom 0.254: J2.5 2.54,43.11
  Bottom 0.305: J2.5 1.02,44.7 1.02,49.99 3.05,52.02 v3.05,53.03 | v30.07,34.75 24.21,40.62 5.04,40.62 2.54,43.11 | v16.66,65.02 15.65,66.04 15.65,79.05 18.49,81.89 44.91,81.89 46.94,79.86 v46.94,70.1 | v78.84,38.61 85.14,38.61 v86.56,37.19 | v92.46,37.19 121.72,37.19 124.56,40.03 124.56,50.42 S1.3 S1.4 | v52.22,70.1 52.22,79.25 54.46,81.48 v62.79,81.48 | v70.71,43.69 v70.71,80.06
RTC_SQW  (via drill 0.51)
  Top 0.305: U2.26 50.28,71.64 52.31,71.64 53.29,70.67 53.29,69.75 52.02,68.48 v52.02,67.87 | v51.21,58.52 46.74,54.05 v46.74,52.02 | v36.58,48.77 v33.53,48.77 | v20.12,59.13 18.9,60.35 R17.2
  Top 0.406: v23.57,48.77 21.14,48.77 U8.3
  Bottom 0.305: v52.02,67.87 52.02,65.03 50.75,63.76 50.75,62.23 51.21,61.77 v51.21,58.52 | v46.74,52.02 46.74,45.31 45.72,44.3 41.05,44.3 v36.58,48.77 | v33.53,48.77 v23.57,48.77 | v20.12,59.13 20.12,52.22
  Bottom 0.406: 20.12,52.22 v23.57,48.77
RTS  (via drill 0.51)
  Top 0.254: U7.3 25.24,30.73 24.38,29.87 24.38,27.84 28.85,23.37 v31.7,23.37
  Bottom 0.254: v31.7,23.37 32.72,24.38 JP1.3
S  (via drill 0.51)
  Top 0.254: v92.46,51.41 v92.46,49.17 | v93.47,42.88 93.47,42.27 v91.03,39.83
  Bottom 0.254: v92.46,51.41 92.46,82.71 93.27,83.53 93.27,86.52 91.59,88.2 JAMMA_IN.S | v92.46,49.17 92.46,43.89 v93.47,42.88 | v91.03,39.83 91.03,6.7 JAMMA_OUT_BTM.S
  Bottom 0.406: JAMMA_IN.S 91.59,95.92 JA2.S
SCL  (via drill 0.51)
  Top 0.254: U2.28 48.22,70.21 47.29,71.14 46.59,71.14 45.9,70.45 45.9,69.76 45.92,69.73 45.92,68.89 v46.13,68.68 | R6.2 30.07,61.16 | 30.07,61.16 37.19,61.16 v37.59,60.76 | U8.16 32.89,51.38 33.93,52.43 33.93,57.3 30.07,61.16
  Bottom 0.254: v46.13,68.68 46.13,68.51 38.37,60.76 v37.59,60.76
SD_CLK  (via drill 0.51)
  Top 0.254: U3.4 35.88,69.17 v35.76,69.29 | v31.9,72.95 27.58,68.63 14.89,68.63 13.41,70.1 13.41,74.78 15.3,76.66 J4.5
  Bottom 0.254: v35.76,69.29 35.56,69.29 v31.9,72.95
SD_CMD  (via drill 0.51)
  Top 0.254: U3.2 37.65,71.53 37.44,71.73 v35.76,71.73 | v19.1,74.37 19.01,74.46 J4.3
  Bottom 0.254: v35.76,71.73 32.98,74.51 30.28,74.51 19.1,74.51
  Bottom 0.305: 19.1,74.51 v19.1,74.37
SD_CS  (via drill 0.51)
  Top 0.254: U3.6 35.98,66.64 v35.76,66.85 | J4.2 19.52,73.36 20.25,74.1 R1.2 23.86,73.15 v29.26,73.15
  Bottom 0.254: v35.76,66.85 35.56,66.85 v29.26,73.15
SDA  (via drill 0.51)
  Top 0.254: U2.27 48.27,71.01 47.48,71.81 46.2,71.81 44.68,70.28 44.68,64.28 v44.75,64.21 | U8.15 29.39,50.11 29.26,49.99 28.38,50.87 R7.2 28.85,56.08 v31.09,58.32
  Bottom 0.254: v44.75,64.21 45.76,63.2 45.76,59.74 44.54,58.52 31.29,58.52 v31.09,58.32
SPK+  (via drill 0.51)
  Top 0.254: 71.73,6.21 JAMMA_OUT_TOP.10
  Top 0.406: v71.73,12.8 71.73,6.21 | v71.79,34.54 71.79,34.49 72.54,33.73 v78.84,33.73 | v86.56,33.73 v92.46,33.73 | v151.38,40.44 R11.1 158.29,40.44 v158.5,40.64 | JAMMA_IN.10 69.49,86.84 69.49,94.02 JA1.10
  Bottom 0.254: 71.79,12.86 v71.73,12.8
  Bottom 0.406: 71.79,12.86 v71.79,34.54 JAMMA_IN.10 | v78.84,33.73 v86.56,33.73 | v92.46,33.73 120.09,33.73 126.8,40.44 v151.38,40.44 | S2.1 164.39,33.48 164.39,38.81 162.56,40.64 v158.5,40.64
SPK-  (via drill 0.51)
  Top 0.406: v86.56,32.11 v92.46,32.11 | v73.27,14.02 73.27,26.53 v78.84,32.11
  Bottom 0.254: 71.93,6.33 JAMMA_OUT_BTM.L
  Bottom 0.406: 71.93,6.33 71.93,10.97 71.79,11.12 71.79,11.27 73.27,12.75 v73.27,14.02 73.27,79.36 73.76,79.86 73.76,87.84 71.97,89.63 JAMMA_IN.L 71.79,95.92 JA2.L | v78.84,32.11 v86.56,32.11 | v92.46,32.11 102.01,32.11 118.26,15.85 168.71,15.85 S2.4 175.36,19.96 175.36,17.42 S2.3
T  (via drill 0.51)
  Top 0.203: v95.5,13.21 82.22,26.49 U6.4 82.22,45.96 82.83,46.57 82.83,69.57 97,83.74 97,85.96 96.97,86 96.97,88.2 JAMMA_IN.T
  Bottom 0.254: v95.5,13.21 95.5,6.19 JAMMA_OUT_BTM.T
  Bottom 0.406: JAMMA_IN.T 95.55,95.92 JA2.T
U  (via drill 0.51)
  Top 0.203: v99.57,13.21 83.49,29.29 U6.5 83.49,45.96 84.1,46.57 84.1,66.68 101.17,83.74 101.17,85.56 99.51,87.21 JAMMA_IN.U
  Bottom 0.254: v99.57,13.21 99.57,6.24 JAMMA_OUT_BTM.U
  Bottom 0.406: JAMMA_IN.U 99.51,95.92 JA2.U
USB_V
  Top 0.254: F1.1 7.21,23.22 13.94,23.22 15.28,24.56 J6.1
USBVCC  (via drill 0.51)
  Top 0.254: F1.2 14.48,21.59 16.42,23.53 16.42,33.25 17.74,34.57 19.78,34.57 U7.20 22.53,34.63 | R4.2 R5.2 22.62,22.82 23.4,23.59 23.4,29.9 24.99,31.5 27.04,31.5 U7.4
  Top 0.305: v61.57,33.12 66.85,33.12 U9.4 | F1.2 5.54,18.75 C9.1 5.55,17.93 C10.1 | 24.99,31.5 22.53,33.96 22.53,34.63 26.3,38.41 28,38.41 33.28,33.12 v34.54,33.12 v34.55,33.12 36.02,34.59 36.02,37.24 37.19,38.41 USBVCC.TP | v51.41,33.12 v46.74,33.12
  Bottom 0.305: v61.57,33.12 v51.41,33.12 | v46.74,33.12 v34.54,33.12
V  (via drill 0.51)
  Top 0.203: v103.43,13.21 84.76,31.88 U6.6 84.76,45.75 85.37,46.36 85.37,51.21 85.37,64.19 105.12,83.94 105.12,85.56 103.47,87.21 JAMMA_IN.V
  Bottom 0.254: v103.43,13.21 103.45,13.19 JAMMA_OUT_BTM.V
  Bottom 0.406: JAMMA_IN.V 103.47,95.92 JA2.V
VCC  (via drill 0.51)
  Top 0.254: 27.23,40.44 v27.13,40.34 | v56.28,75.79 v56.29,75.79
  Top 0.305: U4.3 40.03,45.31 | 10.79,53.97 10.79,54.86 R2.1 | 5.4,60.49 D2.+ | U5.16 95.56,51.87 v96.11,52.43 v86.56,52.43 | U1.16 112.29,49.99 109.86,52.43 v103.43,52.43 | 78.41,48.97 U6.16 | 23.37,55.95 23.57,55.74
  Top 0.356: 23.57,55.74 R7.1 | 14.06,46.62 C8.1 | 62.81,45.9 C13.1
  Top 0.406: U4.3 40.37,46.66 40.84,47.14 41.86,47.14 42.27,46.74 U4.1 | C3.2 43.06,48.62 42.27,47.83 U4.1 | 27.23,40.44 35.15,40.44 38.2,43.49 | J2.2 10.79,53.97 | R2.1 5.4,60.49 | C6.1 53.88,58.2 U2.4 53.88,69.53 56.28,71.93 U2.18 v56.28,75.79 | v64.41,53.85 65.84,52.43 76.2,52.43 v77.62,51 78.41,50.22 78.41,48.97 | R6.1 R7.1 24.99,54.32 24.99,48.77 | 40.03,45.31 38.2,43.49 | 17.55,50.11 17.35,50.11 12.6,54.86 10.79,54.86 | 17.55,50.11 14.06,46.62 | IC1.2 53.35,46.87 | 53.35,46.87 53.12,47.1 42.7,47.1 42.27,46.67 U4.1 | U9.3 72.2,27.09 72.75,27.64 72.75,31.79 70.71,33.82 70.71,41.45 69.22,42.95 U10.8 65.76,42.95 65.02,43.69 | 53.35,46.87 55.95,49.47 55.95,53.01 C6.1 | 65.02,43.69 62.81,45.9 | 65.02,43.69 62.79,43.69 61.57,44.91 61.57,51 v62.99,52.43 60.85,54.57 C6.1 | v61.16,78.44 C14.1 | R17.1 23.37,55.95 | +5V.TP 38.2,42.06 38.2,43.49 | 17.55,50.11 U8.2 23.65,50.11 24.99,48.77 | v24.99,45.52 24.99,48.77
  Bottom 0.305: v103.43,52.43 v96.11,52.43 | v77.62,51 79.05,52.43 v86.56,52.43
  Bottom 0.406: v62.99,52.43 v64.41,53.85 | v24.99,45.52 24.99,42.47 v27.13,40.34 | v56.29,75.79 58.93,78.44 v61.16,78.44
VCC33  (via drill 0.51)
  Top 0.254: v18.09,33.33 17.07,32.31 17.07,23.6 C7.2 | v17.07,36.17 17.48,36.58 U7.17 20.56,36.58 23.08,39.09 28.2,39.09 32.75,34.54 v34.54,34.54 | v60.83,41.66 60.86,41.68 U10.2 | v51.41,34.54 v46.74,34.54
  Bottom 0.254: v17.07,36.17 17.07,34.34 v18.09,33.33 | v60.83,41.66 60.83,36.14 59.19,34.49 51.46,34.49 v51.41,34.54 | v46.74,34.54 v34.54,34.54
VCC_2  (via drill 0.51)
  Top 0.406: v45.11,45.78 45.11,45.55 42.88,43.32 U4.5 42.27,40.44 +3.3V.TP | v45.11,52.02 45.11,52.11 C4.2 38.61,58.61 v38.61,62.38 | U3.1 35.39,72.98 v31.7,69.29 | v29.26,71.73 29.06,71.73 26.82,69.49 15.04,69.49 14.22,70.31 14.22,74.37 15.42,75.56 J4.4
  Bottom 0.406: v45.11,45.78 v45.11,52.02 | v38.61,62.38 v31.7,69.29 v29.26,71.73
VGROUND  (via drill 0.51)
  Top 0.254: v91.03,51.41 v91.03,49.17 | v92.05,42.88 92.05,42.47 v89.41,39.83 | v88.59,12.39 87.61,11.41 JAMMA_OUT_TOP.14 | v87.63,60.55 v94.28,60.55
  Top 0.406: JAMMA_IN.14 87,85.18 v87,86.31 | v85.77,89 85.34,89.42 85.34,94.03 JA1.14
  Bottom 0.254: v91.03,51.41 91.08,51.46 91.08,56.07 87.63,59.53 v87.63,60.55 JAMMA_IN.14 | v91.03,49.17 91.24,48.97 91.24,43.69 v92.05,42.88 | v89.41,39.83 89.41,13.21 v88.59,12.39 | VGA_OUT.6 VGA_OUT.7 VGA_OUT.8 168.81,60.98 167.48,59.64 167.48,58.09 168.81,56.75 VGA_OUT.10 167.42,56.47 VGA_OUT.5 151.12,55.33 145.9,60.55 v94.28,60.55
  Bottom 0.406: v87,86.31 86.49,86.82 86.49,87.77 85.97,88.28 85.97,88.8 v85.77,89
VIN
  Top 0.406: 57.91,50.5 C5.1
  Top 0.762: IC1.1 57.91,50.5 | D5.1 54.28,43.04 57.1,45.85 IC1.1 | R8.2 57.03,29.26 59.33,31.56 59.33,45.31 58.79,45.85 IC1.1
W  (via drill 0.51)
  Top 0.203: JAMMA_IN.W 107.43,87.21 109.08,85.56 109.08,83.69 98.7,73.3 98.7,46.79 98.09,46.18 U5.3 98.15,43.89 98.15,22.35 v107.29,13.21
  Bottom 0.254: v107.29,13.21 107.29,6.29 JAMMA_OUT_BTM.W
  Bottom 0.406: JAMMA_IN.W 107.43,95.92 JA2.W
X  (via drill 0.51)
  Top 0.203: JAMMA_IN.X 111.39,87.42 113.05,85.76 113.05,83.74 99.97,70.67 99.97,46.79 99.36,46.18 U5.4 99.36,42.93 99.42,42.88 99.42,25.15 v111.35,13.21
  Bottom 0.254: v111.35,13.21 111.37,13.19 JAMMA_OUT_BTM.X
  Bottom 0.406: JAMMA_IN.X 111.39,95.92 JA2.X
Y  (via drill 0.51)
  Top 0.203: JAMMA_IN.Y 115.35,87.01 117,85.35 117,83.94 101.24,68.18 101.24,46.79 100.64,46.18 U5.5 100.64,27.99 v115.42,13.21
  Bottom 0.254: v115.42,13.21 115.42,6.25 JAMMA_OUT_BTM.Y
  Bottom 0.406: JAMMA_IN.Y 115.35,95.92 JA2.Y
Z  (via drill 0.51)
  Top 0.203: JAMMA_IN.Z 119.31,87.01 121.17,85.15 121.17,83.94 102.51,65.29 102.51,46.79 101.91,46.18 U5.6 101.91,30.58 v119.28,13.21
  Bottom 0.254: v119.28,13.21 119.29,13.2 JAMMA_OUT_BTM.Z
  Bottom 0.406: JAMMA_IN.Z 119.31,95.92 JA2.Z

## Text on the board
tPlace: SDCARD | SD status | NMA | Jamma Streamer | v0.0.3 | 5V status | VCC | MISO | SCK | MOSI | RST | GND | FTDI_TXD | FTDI_RXD | Mono | Solder to link / DTR to / ATmega's reset / (USB support) | RTS | DTR | pin 10 / PB2 | 5V/3.3V | Stereo